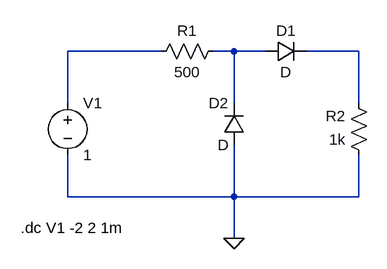
[diagram p0: schematic problem_351.asc]
problem_351.asc, the LTspice schematic file:
Version 4
SHEET 1 880 680
WIRE 96 96 -48 96
WIRE 208 96 176 96
WIRE 256 96 208 96
WIRE 400 96 320 96
WIRE -48 176 -48 96
WIRE 208 176 208 96
WIRE 400 176 400 96
WIRE -48 320 -48 256
WIRE 208 320 208 240
WIRE 208 320 -48 320
WIRE 400 320 400 256
WIRE 400 320 208 320
WIRE 208 384 208 320
FLAG 208 384 0
SYMBOL res 192 80 R90
WINDOW 0 0 56 VBottom 2
WINDOW 3 32 56 VTop 2
SYMATTR InstName R1
SYMATTR Value 500
SYMBOL res 416 272 R180
WINDOW 0 36 76 Left 2
WINDOW 3 36 40 Left 2
SYMATTR InstName R2
SYMATTR Value 1k
SYMBOL diode 256 112 R270
WINDOW 0 32 32 VTop 2
WINDOW 3 0 32 VBottom 2
SYMATTR InstName D1
SYMBOL diode 224 240 R180
WINDOW 0 24 64 Left 2
WINDOW 3 24 0 Left 2
SYMATTR InstName D2
SYMBOL voltage -48 160 R0
WINDOW 123 0 0 Left 0
WINDOW 39 0 0 Left 0
SYMATTR InstName V1
SYMATTR Value 1
TEXT -120 368 Left 2 !.dc V1 -2 2 1m

The netlist it stands for:
* problem_351.asc
R1 N002 N001 500
R2 0 N003 1k
D1 N002 N003 D
D2 0 N002 D
V1 N001 0 1
.model D D
.lib standard.dio
.dc V1 -2 2 1m
.backanno
.end